# Altium schematic sheet a2c.SchDoc
size A; SheetNumber: 1; SheetTotal: 4
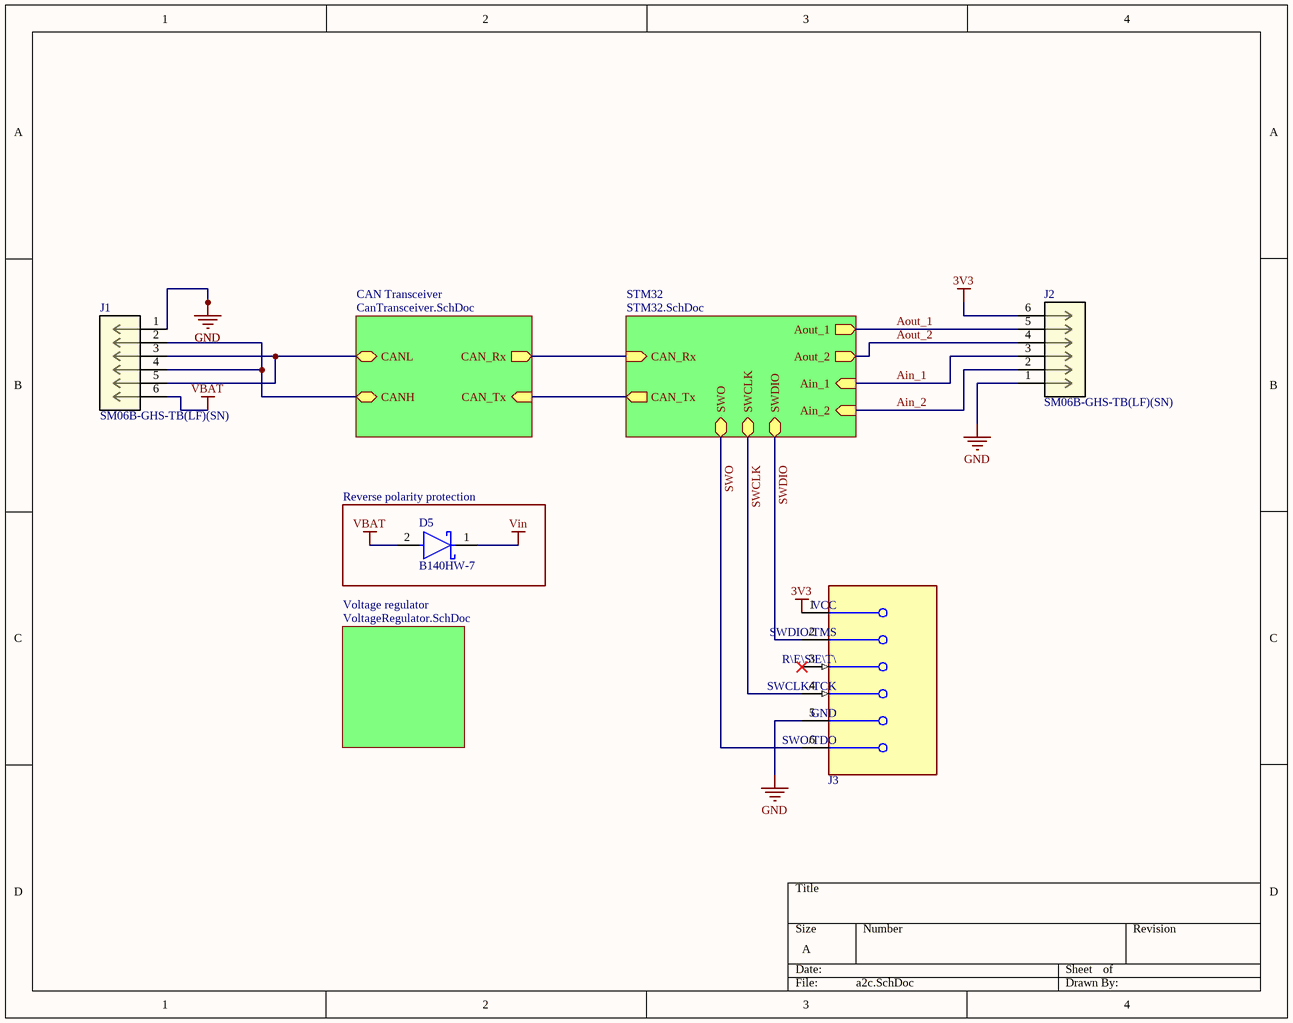
[diagram p0: a2c.SchDoc]

## Parts
D5  B140HW-7  [FP-SOD123-MFG]
J1  SM06B-GHS-TB(LF)(SN)  [CONN_SM06B-GHS-TB_JST]
J2  SM06B-GHS-TB(LF)(SN)  [CONN_SM06B-GHS-TB_JST]
J3  TC2030-CTX-NL  [Tag_Connect_0_MFG]  (value not drawn)

## Blocks framed on the sheet
Reverse polarity protection: D5

## Sub-sheets
CAN Transceiver = CanTransceiver.SchDoc: CAN_Tx (in), CAN_Rx (out), CANH (bidir), CANL (bidir)
STM32 = STM32.SchDoc: CAN_Tx (out), CAN_Rx (in), Aout_1 (out), Aout_2 (out), Ain_1 (in), Ain_2 (in), SWDIO (bidir), SWCLK (bidir), SWO (bidir)
Voltage regulator = VoltageRegulator.SchDoc: no entries

## Nets
3V3: J2.6 J3.1(VCC)
GND: J1.1 J2.1 J3.5(GND)
VBAT: D5.2(A) J1.6
Vin: D5.1(C)
Ain_1: J2.3 ; sheet STM32/Ain_1
Ain_2: J2.2 ; sheet STM32/Ain_2
Aout_1: J2.5 ; sheet STM32/Aout_1
Aout_2: J2.4 ; sheet STM32/Aout_2
SWCLK: J3.4(SWCLK/TCK) ; sheet STM32/SWCLK
SWDIO: J3.2(SWDIO/TMS) ; sheet STM32/SWDIO
SWO: J3.6(SWO/TDO) ; sheet STM32/SWO
NetJ1_2: J1.2 J1.4 ; sheet CAN Transceiver/CANH
NetJ1_3: J1.3 J1.5 ; sheet CAN Transceiver/CANL
(unnamed): sheet STM32/CAN_Tx, sheet CAN Transceiver/CAN_Tx
(unnamed): sheet STM32/CAN_Rx, sheet CAN Transceiver/CAN_Rx

Not connected (* = marked no-connect by the designer): J3 3(~{RESET})*

## Library data of the parts
D5 = CMP-12790-000013-1: DIODE SCHOTTKY 40V 1A SOD123; Manufacturer: Diodes Inc.; Peak Reverse Current: 40uA; Value: 120pF; Standoff Height: 0mm; Max Junction Temp: +125°C; Max Surge Forward Current: 16A; RoHS: TRUE; Ipc Land Pattern Name: SOD365155X110-2; Reverse Voltage: 40V; Temperature Range Low: -65°C; Capacitance: 120pF; Temperature Range High: +125°C; Mouser Description: Schottky Diodes & Rectifiers SCHOTTKY RECTIFIER SOD-123 1.0A 40V; ComponentLink2URL: https://www.diodes.com/assets/Datasheets/ds30670.pdf; Automotive: No; Package: SOD123; Octopart: https://octopart.com/b140hw-7-diodes+inc.-325751; Footprint Url: https://www.diodes.com/assets/Package-Files/SOD123.pdf; Max Repetitive Reverse Voltage: 40V; Category: Diode; Device Class L3: Schottky Diodes; Manufacturer Part Number: B140HW-7; Digikey Description: DIODE SCHOTTKY 40V 1A SOD123; Lead Free: Yes; Device Class L1: Discrete Semiconductors; ComponentLink2Description: Datasheet; Forward Current: 1A; Device Class L2: Diodes; Temperature: -65°C to +125°C; Height: 1.45mm
J1 J2 = SM06B-GHS-TB(LF)(SN): No Description Available; Manufacturer: JST; Manufacturer Part Number: B6B-ZR-SM4-TF(LF)(SN); Conn Orientation: Straight; Pitch: 1.5mm; Current Rating: 1A; Number Of Contacts: 6; Conn Gender: Male; Height: 5mm; Device Class L1: Connectors; Device Class L3: unset; Octopart: https://octopart.com/b6b-zr-sm4-tf%28lf%29%28sn%29-jst-248849; Package: B6B-ZR-SM4-TF(LF)(SN); Contact Material: Tin; Automotive: No; ComponentLink2URL: http://www.jst-mfg.com/product/pdf/eng/eZH.pdf; Digikey Description: CONN HEADER SMD 6POS 1.5MM; ComponentLink2Description: Datasheet; Temperature: -25°C to +85°C; Temperature Range Low: -25°C; Temperature Range High: +85°C; Number Of Rows: 1; RoHS: TRUE; Device Class L2: Board to Board Connectors; Lead Free: Yes; Category: Conn; Copyright: Copyright (C) 2021 Ultra Librarian. All rights reserved.; Digi-Key_Part_Number_1: 455-1568-2-ND; Digi-Key_Part_Number_2: 455-1568-1-ND; Digi-Key_Part_Number_3: 455-1568-6-ND; Manufacturer_Part_Number: SM06B-GHS-TB(LF)(SN); Mfr_Name: JST; RefDes: RefDes; Type: DEV